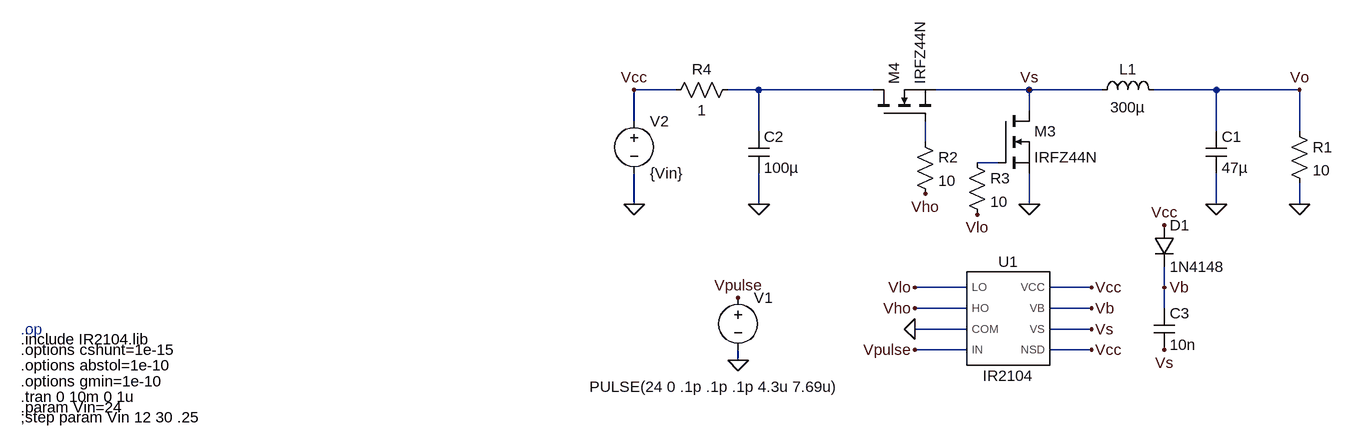
[diagram p0: schematic fuente_conmutada_1.asc]
fuente_conmutada_1.asc, the LTspice schematic file:
Version 4.1
SHEET 1 1600 984
WIRE -192 112 -256 112
WIRE -64 112 -112 112
WIRE 112 112 -64 112
WIRE 352 112 208 112
WIRE 464 112 352 112
WIRE 640 112 544 112
WIRE 768 112 640 112
WIRE 352 144 352 112
WIRE -256 160 -256 112
WIRE -64 176 -64 112
WIRE 640 176 640 112
WIRE 768 176 768 112
WIRE 192 192 192 160
WIRE 304 224 272 224
WIRE -256 288 -256 240
WIRE -64 288 -64 240
WIRE 352 288 352 240
WIRE 640 288 640 240
WIRE 768 288 768 256
WIRE 256 416 176 416
WIRE 448 416 384 416
WIRE 560 416 560 384
WIRE 256 448 176 448
WIRE 448 448 384 448
WIRE 560 448 560 416
WIRE 256 480 176 480
WIRE 448 480 384 480
WIRE 256 512 176 512
WIRE 448 512 384 512
WIRE -96 528 -96 512
FLAG 768 288 0
FLAG 640 288 0
FLAG 352 288 0
FLAG -64 288 0
FLAG -96 528 0
FLAG -256 288 0
FLAG 768 112 Vo
FLAG 176 480 0
FLAG 176 512 Vpulse
FLAG -96 432 Vpulse
FLAG -256 112 Vcc
FLAG 448 416 Vcc
FLAG 560 320 Vcc
FLAG 448 480 Vs
FLAG 560 512 Vs
FLAG 448 448 Vb
FLAG 560 416 Vb
FLAG 448 512 Vcc
FLAG 176 416 Vlo
FLAG 272 304 Vlo
FLAG 176 448 Vho
FLAG 192 272 Vho
FLAG 352 112 Vs
SYMBOL ind 448 128 R270
WINDOW 0 32 56 VTop 2
WINDOW 3 5 56 VBottom 2
SYMATTR InstName L1
SYMATTR Value 300µ
SYMBOL cap 624 176 R0
SYMATTR InstName C1
SYMATTR Value 47µ
SYMBOL res 752 160 R0
SYMATTR InstName R1
SYMATTR Value 10
SYMBOL cap -80 176 R0
SYMATTR InstName C2
SYMATTR Value 100µ
SYMBOL voltage -96 416 R0
WINDOW 123 0 0 Left 0
WINDOW 39 0 0 Left 0
WINDOW 3 -229 153 Left 2
SYMATTR Value PULSE(24 0 .1p .1p .1p 4.3u 7.69u)
SYMATTR InstName V1
SYMBOL voltage -256 144 R0
WINDOW 123 0 0 Left 0
WINDOW 39 0 0 Left 0
SYMATTR InstName V2
SYMATTR Value {Vin}
SYMBOL nmos 112 160 R270
SYMATTR InstName M4
SYMATTR Value IRFZ44N
SYMBOL cap 544 448 R0
SYMATTR InstName C3
SYMATTR Value 10n
SYMBOL diode 544 320 R0
SYMATTR InstName D1
SYMATTR Value 1N4148
SYMBOL res 176 176 R0
SYMATTR InstName R2
SYMATTR Value 10
SYMBOL res 256 208 R0
SYMATTR InstName R3
SYMATTR Value 10
SYMBOL nmos 304 144 R0
SYMATTR InstName M3
SYMATTR Value IRFZ44N
SYMBOL res -96 96 R90
WINDOW 0 0 56 VBottom 2
WINDOW 3 32 56 VTop 2
SYMATTR InstName R4
SYMATTR Value 1
SYMBOL IR2104 320 464 R0
SYMATTR InstName U1
TEXT -1200 584 Left 2 !.tran 0 10m 0 1u
TEXT -1200 616 Left 2 !;step param Vin 12 30 .25
TEXT -1200 480 Left 2 ;.op
TEXT -1200 600 Left 2 !.param Vin=24
TEXT -1200 496 Left 2 !.include IR2104.lib
TEXT -1200 512 Left 2 !.options cshunt=1e-15
TEXT -1200 536 Left 2 !.options abstol=1e-10
TEXT -1200 560 Left 2 !.options gmin=1e-10

The netlist it stands for:
* fuente_conmutada_1.asc
L1 Vs Vo 300µ
C1 Vo 0 47µ
R1 Vo 0 10
C2 N001 0 100µ
V1 Vpulse 0 PULSE(24 0 .1p .1p .1p 4.3u 7.69u)
V2 Vcc 0 {Vin}
M4 N001 N002 Vs Vs IRFZ44N
C3 Vb Vs 10n
D1 Vcc Vb 1N4148
R2 N002 Vho 10
R3 N003 Vlo 10
M3 Vs N003 0 0 IRFZ44N
R4 N001 Vcc 1
X§U1 Vlo Vho 0 Vpulse Vcc Vb Vs Vcc IR2104  ; pins LO HO COM IN VCC VB VS NSD
.model D D
.lib standard.dio
.model NMOS NMOS
.model PMOS PMOS
.lib standard.mos
.tran 0 10m 0 1u
;step param Vin 12 30 .25
* .op
.param Vin=24
.include IR2104.lib
.options cshunt=1e-15
.options abstol=1e-10
.options gmin=1e-10
.lib IR2104.lib
.backanno
.end